# EAGLE schematic Rover Motor Controller R2 (EAGLE 7.1.0)
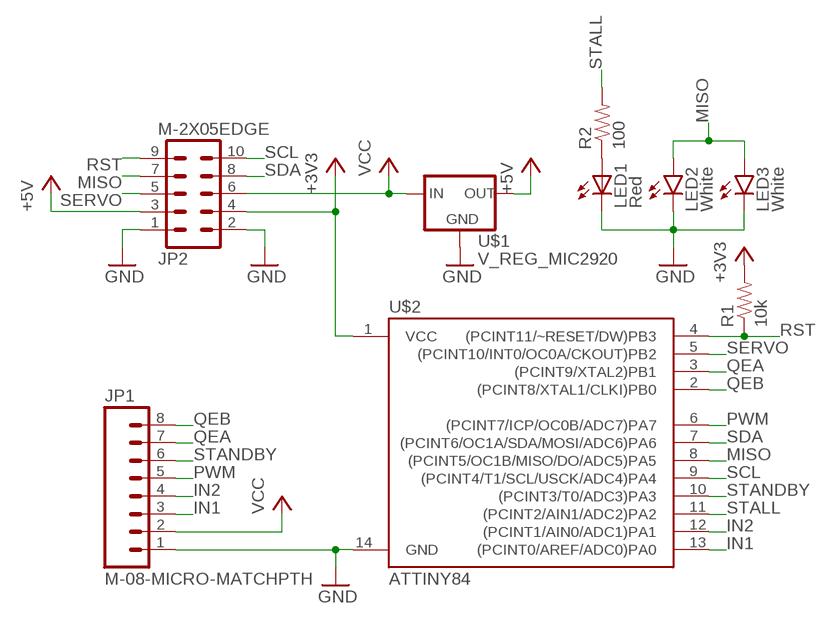
[diagram p0: schematic, sheet 1]

## Parts
JP1  M-08-MICRO-MATCHPTH  [M-08-MICRO-MATCH-PTH]
JP2  M-2X05EDGE  [M-2X05-0.1-EDGE]
LED1  Red  LEDSML0603  [SML0603]
LED2  White  LEDSMD-RA  [LED-SMD-RA]
LED3  White  LEDSMD-RA  [LED-SMD-RA]
R1  10k  RESISTOR0603  [R0603]
R2  100  RESISTOR0603  [R0603]
U$1  V_REG_MIC2920  [SOT223]
U$2  ATTINY84  [SO14]

## Nets
+3V3: JP2.4 R1.2 U$2.1(VCC)
+5V: JP2.3 U$1.3(OUT)
GND: JP1.1 JP2.1 JP2.2 LED1.C LED2.C LED3.C U$1.2(GND) U$2.14(GND)
IN1: JP1.3 U$2.13((PCINT0/AREF/ADC0)PA0)
IN2: JP1.4 U$2.12((PCINT1/AIN0/ADC1)PA1)
MISO: JP2.7 LED2.A LED3.A U$2.8((PCINT5/OC1B/MISO/DO/ADC5)PA5)
N$1: LED1.A R2.1
PWM: JP1.5 U$2.6((PCINT7/ICP/OC0B/ADC7)PA7)
QEA: JP1.7 U$2.3((PCINT9/XTAL2)PB1)
QEB: JP1.8 U$2.2((PCINT8/XTAL1/CLKI)PB0)
RST: JP2.9 R1.1 U$2.4((PCINT11/~RESET/DW)PB3)
SCL: JP2.10 U$2.9((PCINT4/T1/SCL/USCK/ADC4)PA4)
SDA: JP2.8 U$2.7((PCINT6/OC1A/SDA/MOSI/ADC6)PA6)
SERVO: JP2.5 U$2.5((PCINT10/INT0/OC0A/CKOUT)PB2)
STALL: R2.2 U$2.11((PCINT2/AIN1/ADC2)PA2)
STANDBY: JP1.6 U$2.10((PCINT3/T0/ADC3)PA3)
VCC: JP1.2 JP2.6 U$1.1(IN)

## Library data of the parts
JP1 = Jordi:M-08-MICRO-MATCH
JP2 = Jordi:M-2X05
LED1 = led:LED: LED OSRAM: - CHIPLED LG R971, LG N971, LY N971, LG Q971, LY Q971, LO R971, LY R971 LH N974, LH R974 LS Q976, LO Q976, LY Q976 LO Q996 - Hyper CHIPLED LW Q18S LB Q993, LB Q99A, LB R99A - SideLED LS A670, LO A670, LY A670, LG A670, LP A670 LB A673, LV A673, LT A673, LW A673 LH A674 LY A675 LS A676, LA A676, LO A676, LY A676, LW A676 LS A679, LY A679, LG A679 - Hyper Micro SIDELED® LS Y876, LA Y876, LO Y876, LY Y876 LT Y87S - SmartLED LW L88C, LW L88S LB L89C, LB L89S, LG L890 LS L89K, LO L89K, LY L89K LS L896, LA L896, LO L896, LY L896 - TOPLED LS T670, LO T670, LY T670, LG T670, LP T670 LSG T670, LSP T670, LSY T670, LOP T670, LYG T670 LG T671, LOG T671, LSG T671 LB T673, LV T673, LT T673, LW T673 LH T674 LS T676, LA T676, LO T676, LY T676, LB T676, LH T676, LSB T676, LW T676 LB T67C, LV T67C, LT T67C, LS T67K, LO T67K, LY T67K, LW E67C LS E67B, LA E67B, LO E67B, LY E67B, LB E67C, LV E67C, LT E67C LW T67C LS T679, LY T679, LG T679 LS T770, LO T770, LY T770, LG T770, LP T770 LB T773, LV T773, LT T773, LW T773 LH T774 LS E675, LA E675, LY E675, LS T675 LS T776, LA T776, LO T776, LY T776, LB T776 LHGB T686 LT T68C, LB T68C - Hyper Mini TOPLED® LB M676 - Mini TOPLED Santana® LG M470 LS M47K, LO M47K, LY M47K Source: http://www.osram.convergy.de LUXEON: - LUMILED® LXK2-PW12-R00, LXK2-PW12-S00, LXK2-PW14-U00, LXK2-PW14-V00 LXK2-PM12-R00, LXK2-PM12-S00, LXK2-PM14-U00 LXK2-PE12-Q00, LXK2-PE12-R00, LXK2-PE12-S00, LXK2-PE14-T00, LXK2-PE14-U00 LXK2-PB12-K00, LXK2-PB12-L00, LXK2-PB12-M00, LXK2-PB14-N00, LXK2-PB14-P00, LXK2-PB14-Q00 LXK2-PR12-L00, LXK2-PR12-M00, LXK2-PR14-Q00, LXK2-PR14-R00 LXK2-PD12-Q00, LXK2-PD12-R00, LXK2-PD12-S00 LXK2-PH12-R00, LXK2-PH12-S00 LXK2-PL12-P00, LXK2-PL12-Q00, LXK2-PL12-R00 Source: www.luxeon.com KINGBRIGHT: KA-3528ASYC Source: www.kingbright.com
LED2 LED3 = Jordi:LED
R1 R2 = Jordi:RESISTOR
U$1 = SparkFun-PowerIC:V_REG_MIC2920: MIC2920A (http://www.micrel.com/_PDF/mic2920.pdf) - 400mA output LDO Regulator
U$2 = SparkFun-DigitalIC:ATTINY84: Atmel 14-pin 2/4/8kB flash uC